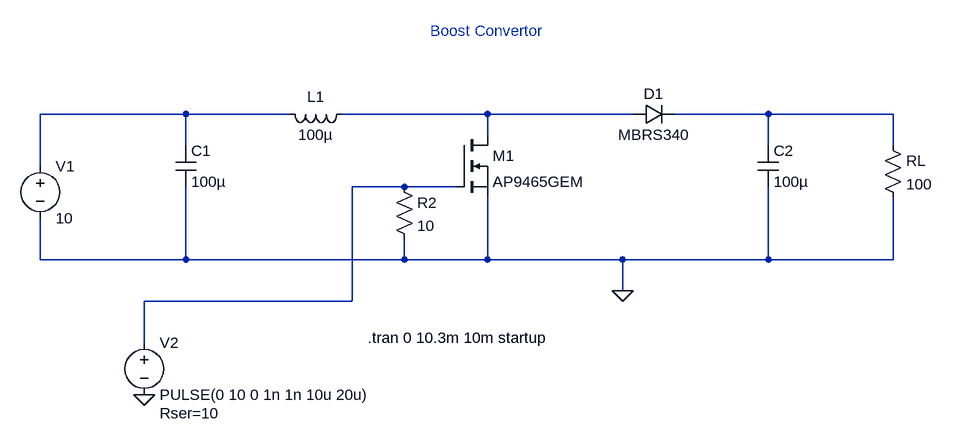
[diagram p0: schematic Boost_Convertor.asc]
Boost_Convertor.asc, the LTspice schematic file:
Version 4.1
SHEET 1 1044 680
WIRE -112 -368 -336 -368
WIRE 48 -368 -112 -368
WIRE 352 -368 128 -368
WIRE 576 -368 352 -368
WIRE 784 -368 640 -368
WIRE 976 -368 784 -368
WIRE 352 -336 352 -368
WIRE -112 -320 -112 -368
WIRE 784 -320 784 -368
WIRE 976 -320 976 -368
WIRE -336 -288 -336 -368
WIRE 224 -256 144 -256
WIRE 304 -256 224 -256
WIRE -336 -144 -336 -208
WIRE -112 -144 -112 -256
WIRE -112 -144 -336 -144
WIRE 224 -144 224 -176
WIRE 224 -144 -112 -144
WIRE 352 -144 352 -240
WIRE 352 -144 224 -144
WIRE 560 -144 352 -144
WIRE 784 -144 784 -256
WIRE 784 -144 560 -144
WIRE 976 -144 976 -240
WIRE 976 -144 784 -144
WIRE 560 -96 560 -144
WIRE 144 -80 144 -256
WIRE 144 -80 -176 -80
WIRE -176 -16 -176 -80
FLAG 560 -96 0
FLAG -176 64 0
SYMBOL voltage -336 -304 R0
WINDOW 123 0 0 Left 0
WINDOW 39 0 0 Left 0
SYMATTR InstName V1
SYMATTR Value 10
SYMBOL cap -128 -320 R0
SYMATTR InstName C1
SYMATTR Value 100µ
SYMBOL ind 144 -384 R90
WINDOW 0 5 56 VBottom 2
WINDOW 3 32 56 VTop 2
SYMATTR InstName L1
SYMATTR Value 100µ
SYMATTR SpiceLine Rser=1m
SYMBOL nmos 304 -336 R0
SYMATTR InstName M1
SYMATTR Value AP9465GEM
SYMBOL diode 576 -352 R270
WINDOW 0 32 32 VTop 2
WINDOW 3 0 32 VBottom 2
SYMATTR InstName D1
SYMATTR Value MBRS340
SYMATTR Description Diode
SYMATTR Type diode
SYMBOL cap 768 -320 R0
SYMATTR InstName C2
SYMATTR Value 100µ
SYMATTR SpiceLine Rser=0.1
SYMBOL res 960 -336 R0
SYMATTR InstName RL
SYMATTR Value 100
SYMBOL res 208 -272 R0
SYMATTR InstName R2
SYMATTR Value 10
SYMBOL voltage -176 -32 R0
WINDOW 123 0 0 Left 0
WINDOW 39 24 124 Left 2
SYMATTR InstName V2
SYMATTR Value PULSE(0 10 0 1n 1n 10u 20u)
SYMATTR SpiceLine Rser=10
TEXT 168 -24 Left 2 !.tran 0 10.3m 10m startup
TEXT 264 -496 Left 2 ;Boost Convertor

The netlist it stands for:
* Boost_Convertor.asc
V1 N001 0 10
C1 N001 0 100µ
L1 N002 N001 100µ Rser=1m
M1 N002 N004 0 0 AP9465GEM
D1 N002 N003 MBRS340
C2 N003 0 100µ Rser=0.1
RL N003 0 100
R2 N004 0 10
V2 N004 0 PULSE(0 10 0 1n 1n 10u 20u) Rser=10
.model D D
.lib standard.dio
.model NMOS NMOS
.model PMOS PMOS
.lib standard.mos
.tran 0 10.3m 10m startup
* Boost Convertor
.backanno
.end